# EAGLE design square (EAGLE 8.2.2)

## Sheet 1 of 4
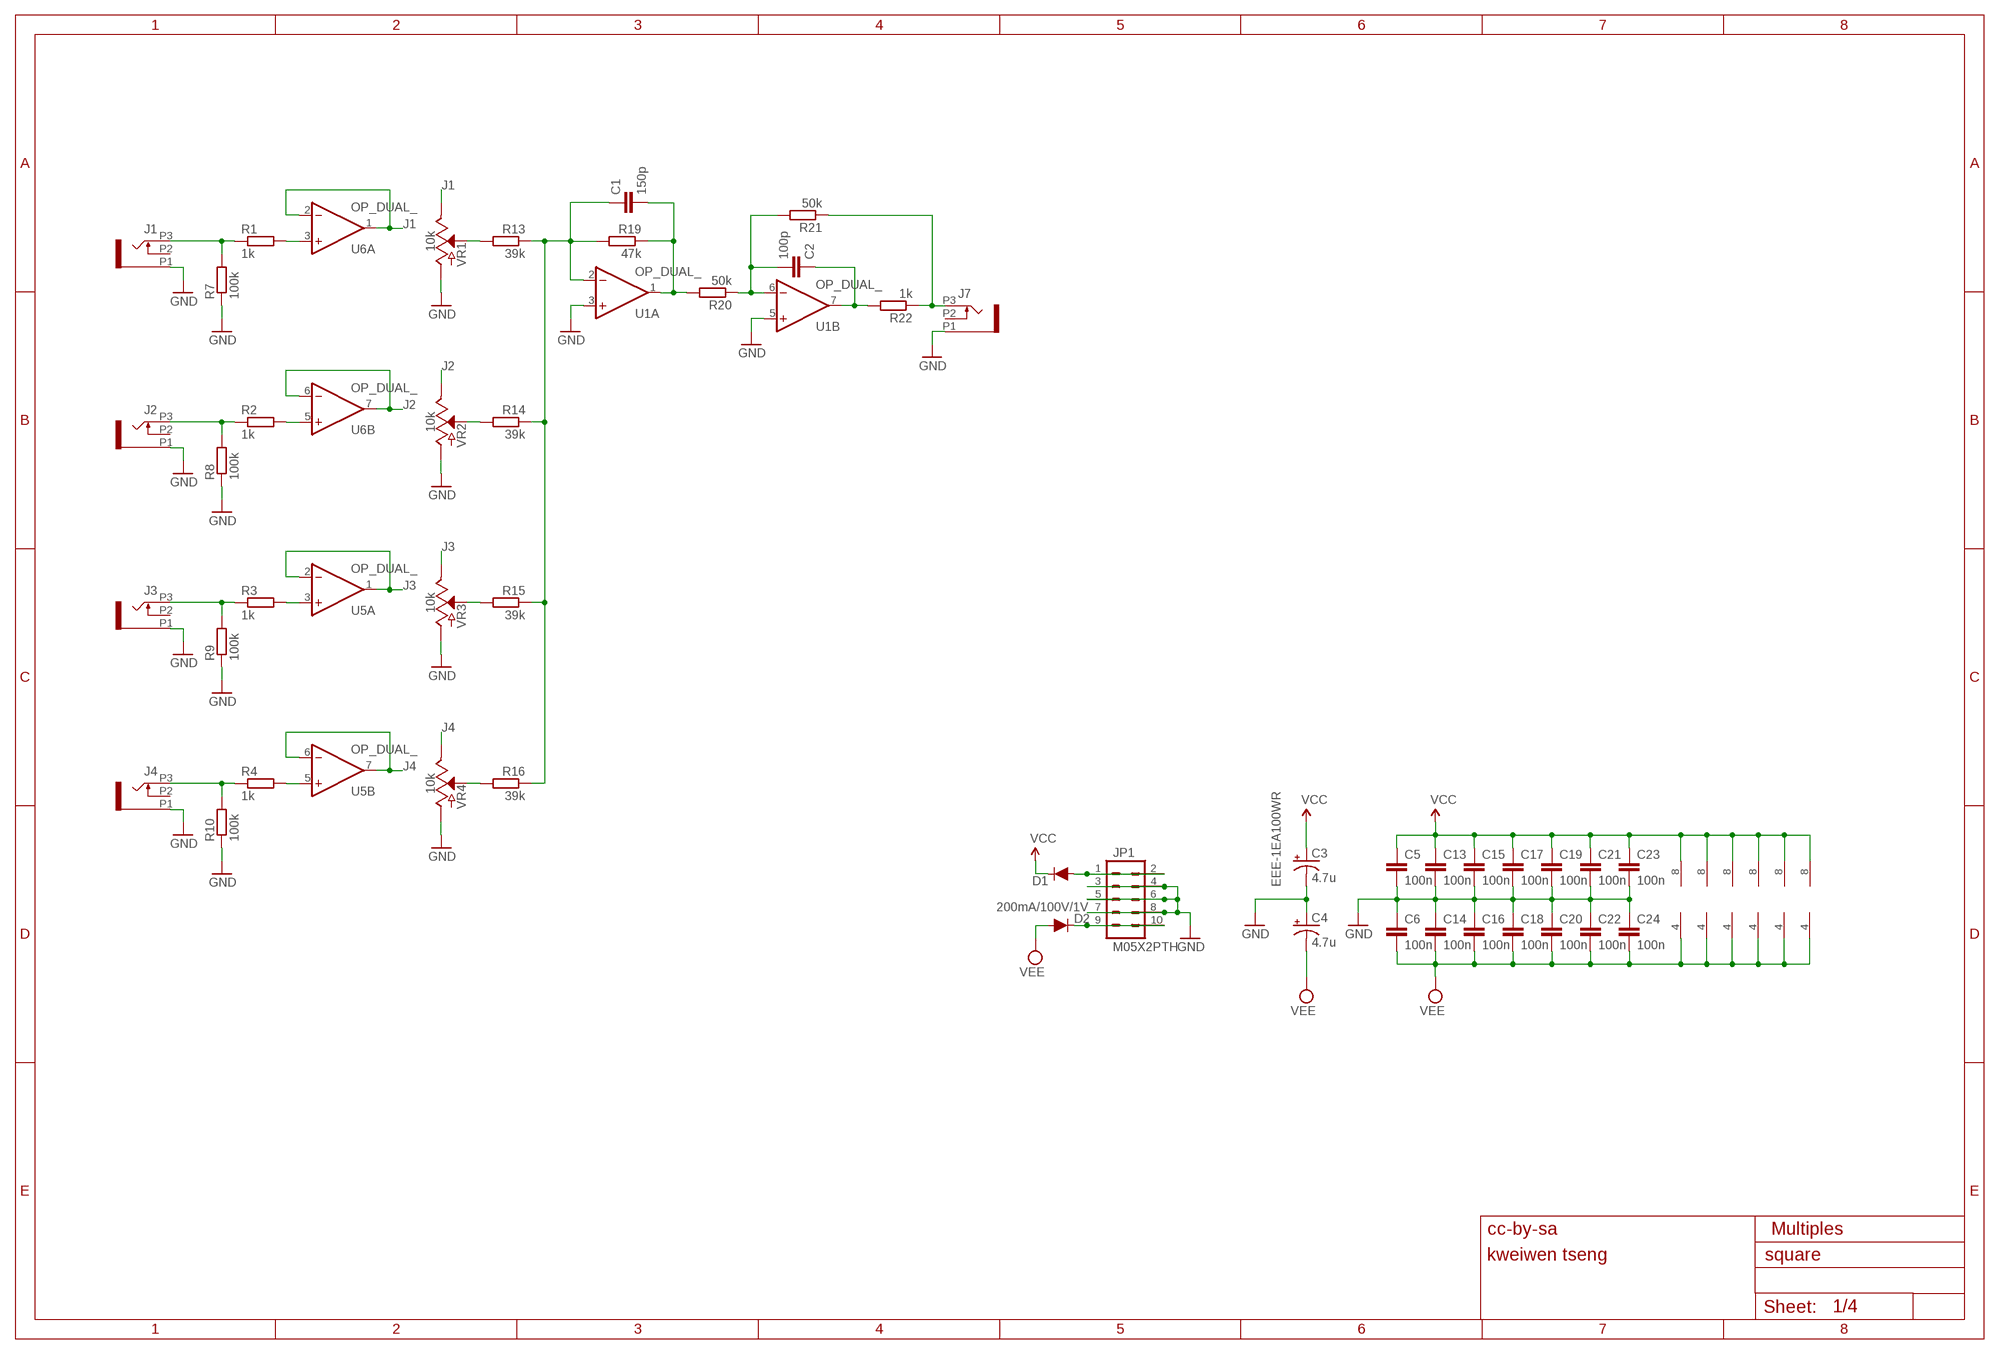
[diagram p0: schematic, sheet 1]

### Parts
C1  150p  C5/2.5  [C5B2.5]
C2  100p  C5/2.5  [C5B2.5]
C3  4.7u  CPOL-USE2.5-6  [E2,5-6]
C4  4.7u  CPOL-USE2.5-6  [E2,5-6]
C5  100n  C5/2.5  [C5B2.5]
C6  100n  C5/2.5  [C5B2.5]
C13  100n  C5/2.5  [C5B2.5]
C14  100n  C5/2.5  [C5B2.5]
C15  100n  C5/2.5  [C5B2.5]
C16  100n  C5/2.5  [C5B2.5]
C17  100n  C5/2.5  [C5B2.5]
C18  100n  C5/2.5  [C5B2.5]
C19  100n  C5/2.5  [C5B2.5]
C20  100n  C5/2.5  [C5B2.5]
C21  100n  C5/2.5  [C5B2.5]
C22  100n  C5/2.5  [C5B2.5]
C23  100n  C5/2.5  [C5B2.5]
C24  100n  C5/2.5  [C5B2.5]
D1  200mA/100V/1V  DIODE-1N4148  [DIODE-1N4148]
D2  200mA/100V/1V  DIODE-1N4148  [DIODE-1N4148]
J1  PJ301_THONKICONN6  [WQP_PJ_301M6]
J2  PJ301_THONKICONN6  [WQP_PJ_301M6]
J3  PJ301_THONKICONN6  [WQP_PJ_301M6]
J4  PJ301_THONKICONN6  [WQP_PJ_301M6]
J7  PJ301_THONKICONN6  [WQP_PJ_301M6]
JP1  M05X2PTH  [AVR_ICSP]
R1  1k  RESISTORVERTICAL  [VERTICAL_RESISTOR]
R2  1k  RESISTORVERTICAL  [VERTICAL_RESISTOR]
R3  1k  RESISTORVERTICAL  [VERTICAL_RESISTOR]
R4  1k  RESISTORVERTICAL  [VERTICAL_RESISTOR]
R7  100k  RESISTORVERTICAL  [VERTICAL_RESISTOR]
R8  100k  RESISTORVERTICAL  [VERTICAL_RESISTOR]
R9  100k  RESISTORVERTICAL  [VERTICAL_RESISTOR]
R10  100k  RESISTORVERTICAL  [VERTICAL_RESISTOR]
R13  39k  RESISTORVERTICAL  [VERTICAL_RESISTOR]
R14  39k  RESISTORVERTICAL  [VERTICAL_RESISTOR]
R15  39k  RESISTORVERTICAL  [VERTICAL_RESISTOR]
R16  39k  RESISTORVERTICAL  [VERTICAL_RESISTOR]
R19  47k  RESISTORVERTICAL  [VERTICAL_RESISTOR]
R20  50k  RESISTORVERTICAL  [VERTICAL_RESISTOR]
R21  50k  RESISTORVERTICAL  [VERTICAL_RESISTOR]
R22  1k  RESISTORVERTICAL  [VERTICAL_RESISTOR]
U1  OP_DUAL_  [DIL08]
U2  OP_DUAL_  [DIL08]
U3  OP_DUAL_  [DIL08]
U4  OP_DUAL_  [DIL08]
U5  OP_DUAL_  [DIL08]
U6  OP_DUAL_  [DIL08]
VR1  10k  POTENTIOMETER-PTH-9MM-1/20W-20%-KIT  [POT-PTH-ALPS-KIT]
VR2  10k  POTENTIOMETER-PTH-9MM-1/20W-20%-KIT  [POT-PTH-ALPS-KIT]
VR3  10k  POTENTIOMETER-PTH-9MM-1/20W-20%-KIT  [POT-PTH-ALPS-KIT]
VR4  10k  POTENTIOMETER-PTH-9MM-1/20W-20%-KIT  [POT-PTH-ALPS-KIT]

### Nets
GND: C3.- C4.+ C5.2 C6.1 J1.P1 J2.P1 J3.P1 J4.P1 J7.P1 JP1.3 JP1.4 JP1.5 JP1.6 JP1.7 JP1.8 R7.1 R8.1 R9.1 R10.1 U1.3(A:+IN) U1.5(B:+IN) VR1.P$1(A) VR2.P$1(A) VR3.P$1(A) VR4.P$1(A) ; also sheet 2,3,4
GND1: C13.2 C14.1
GND2: C15.2 C16.1
GND3: C17.2 C18.1
GND4: C19.2 C20.1
GND5: C21.2 C22.1
GND6: C23.2 C24.1
J1: U6.1(A:OUT) U6.2(A:-IN) VR1.P$3(E) ; also sheet 2,3,4
J2: U6.6(B:-IN) U6.7(B:OUT) VR2.P$3(E) ; also sheet 2,3,4
J3: U5.1(A:OUT) U5.2(A:-IN) VR3.P$3(E) ; also sheet 2,3,4
J4: U5.6(B:-IN) U5.7(B:OUT) VR4.P$3(E) ; also sheet 2,3,4
N$1: C1.1 R13.1 R14.1 R15.1 R16.1 R19.2 U1.2(A:-IN)
N$2: R13.2 VR1.P$2(S)
N$3: R16.2 VR4.P$2(S)
N$4: R1.2 U6.3(A:+IN)
N$5: R14.2 VR2.P$2(S)
N$6: D1.A JP1.1 JP1.2
N$7: R15.2 VR3.P$2(S)
N$9: C1.2 R19.1 R20.2 U1.1(A:OUT)
N$10: C2.2 R20.1 R21.2 U1.6(B:-IN)
N$11: C2.1 R22.2 U1.7(B:OUT)
N$12: J7.P3 R21.1 R22.1
N$15: R2.2 U6.5(B:+IN)
N$17: R3.2 U5.3(A:+IN)
N$20: D2.C JP1.9 JP1.10
N$21: J1.P3 R1.1 R7.2
N$31: J2.P3 R2.1 R8.2
N$33: J3.P3 R3.1 R9.2
N$34: J4.P3 R4.1 R10.2
N$40: R4.2 U5.5(B:+IN)
VCC: C3.+ C5.1 C13.1 C15.1 C17.1 C19.1 C21.1 C23.1 D1.C U1.8(P:V+) U2.8(P:V+) U3.8(P:V+) U4.8(P:V+) U5.8(P:V+) U6.8(P:V+)
VEE: C4.- C6.2 C14.2 C16.2 C18.2 C20.2 C22.2 C24.2 D2.A U1.4(P:V-) U2.4(P:V-) U3.4(P:V-) U4.4(P:V-) U5.4(P:V-) U6.4(P:V-)
Unconnected: J1.P2 J2.P2 J3.P2 J4.P2 J7.P2

### Notes on the sheet
- EEE-1EA100WR
- cc-by-sa | Multiples
- kweiwen tseng

## Sheet 2 of 4
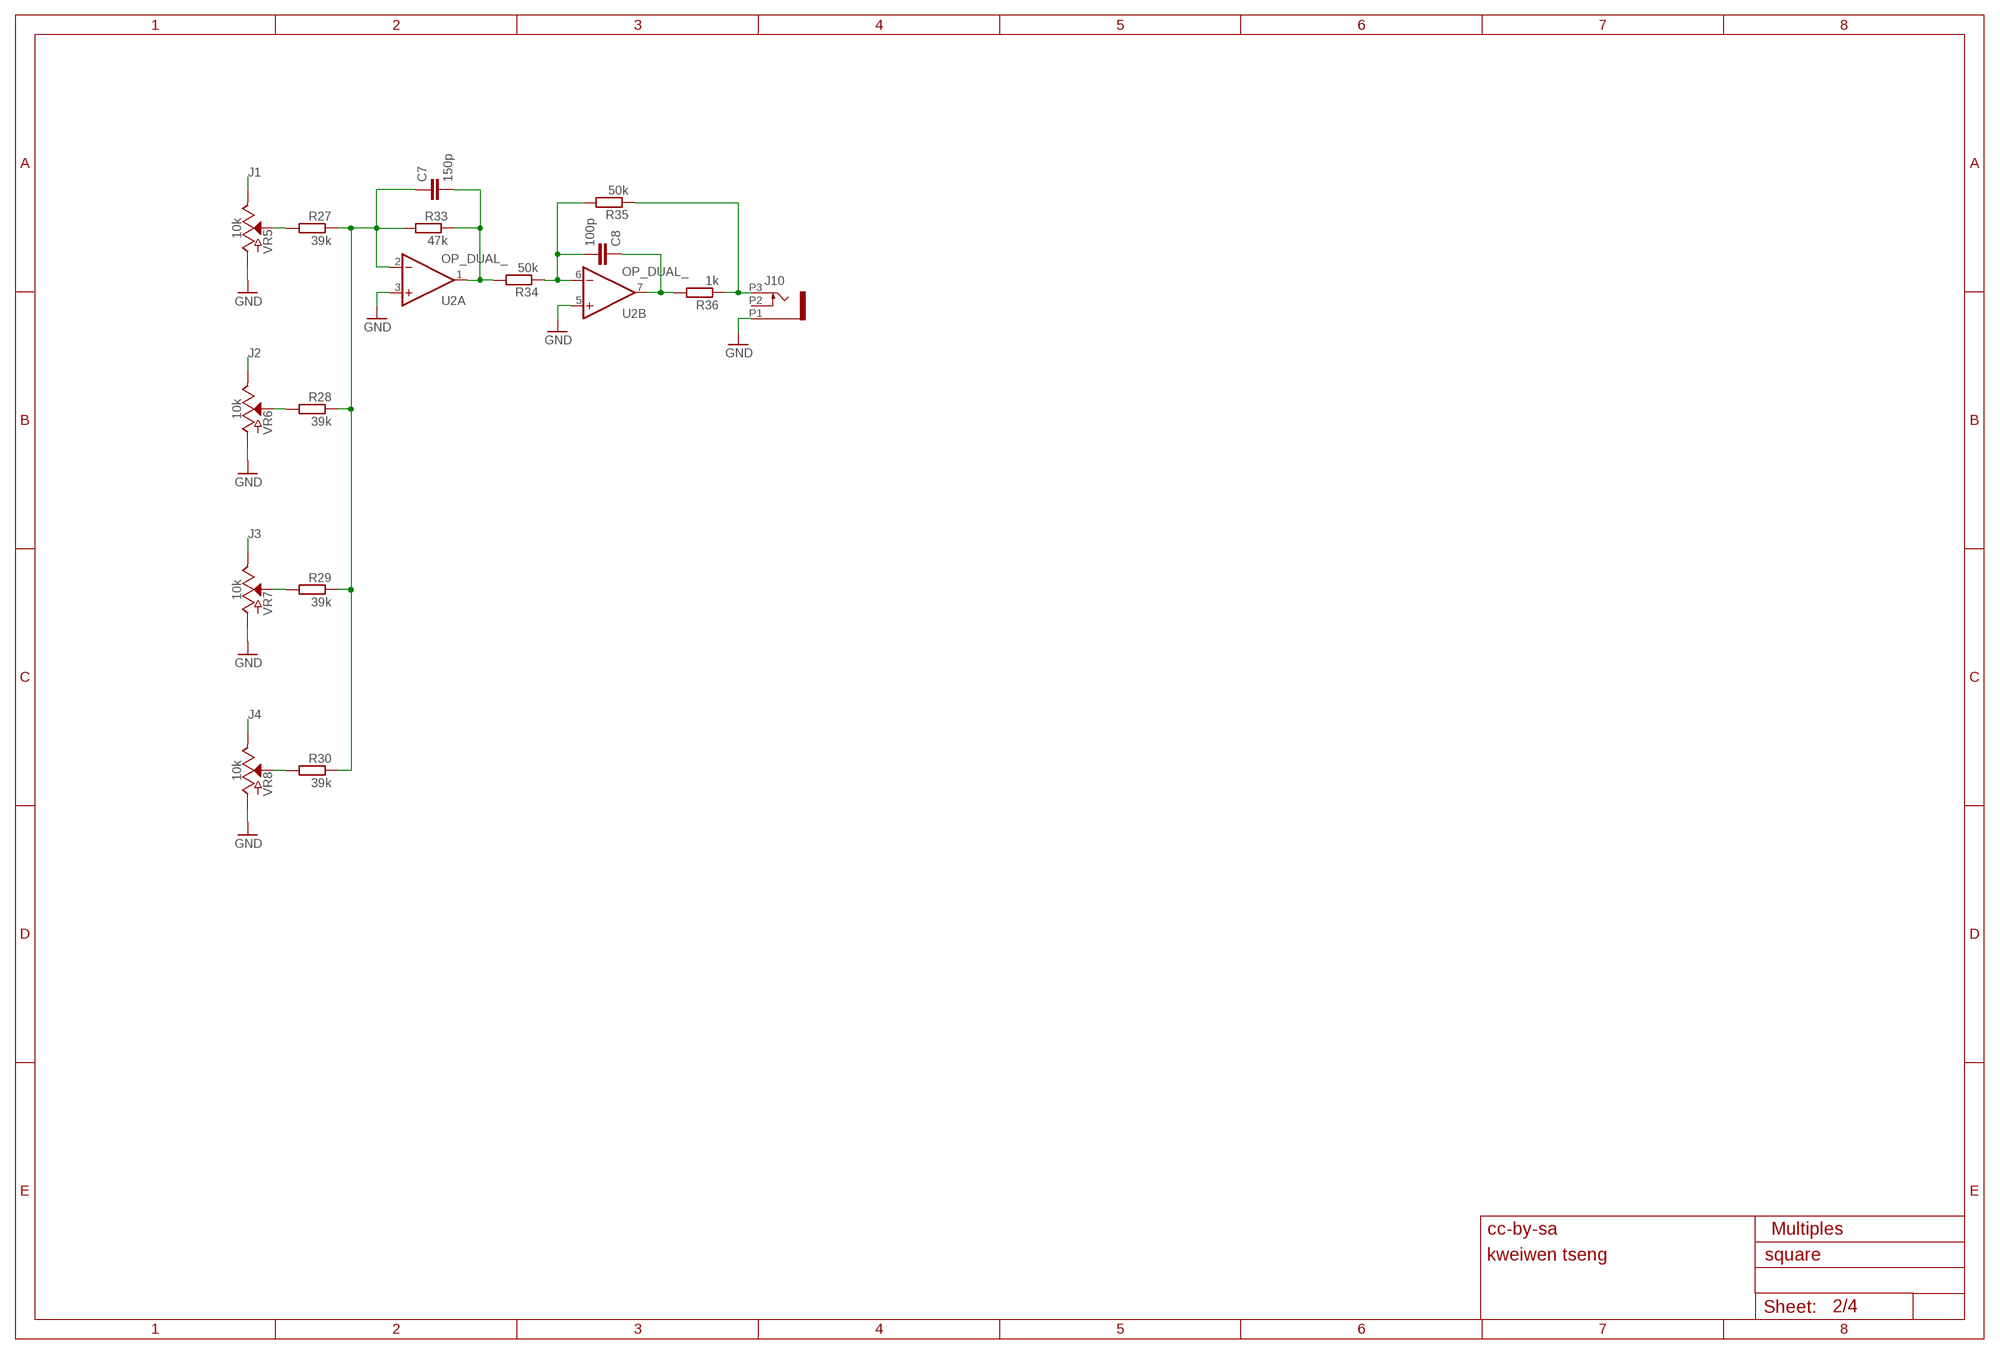
[diagram p1: schematic, sheet 2]

### Parts
C7  150p  C5/2.5  [C5B2.5]
C8  100p  C5/2.5  [C5B2.5]
J10  PJ301_THONKICONN6  [WQP_PJ_301M6]
R27  39k  RESISTORVERTICAL  [VERTICAL_RESISTOR]
R28  39k  RESISTORVERTICAL  [VERTICAL_RESISTOR]
R29  39k  RESISTORVERTICAL  [VERTICAL_RESISTOR]
R30  39k  RESISTORVERTICAL  [VERTICAL_RESISTOR]
R33  47k  RESISTORVERTICAL  [VERTICAL_RESISTOR]
R34  50k  RESISTORVERTICAL  [VERTICAL_RESISTOR]
R35  50k  RESISTORVERTICAL  [VERTICAL_RESISTOR]
R36  1k  RESISTORVERTICAL  [VERTICAL_RESISTOR]
VR5  10k  POTENTIOMETER-PTH-9MM-1/20W-20%-KIT  [POT-PTH-ALPS-KIT]
VR6  10k  POTENTIOMETER-PTH-9MM-1/20W-20%-KIT  [POT-PTH-ALPS-KIT]
VR7  10k  POTENTIOMETER-PTH-9MM-1/20W-20%-KIT  [POT-PTH-ALPS-KIT]
VR8  10k  POTENTIOMETER-PTH-9MM-1/20W-20%-KIT  [POT-PTH-ALPS-KIT]

### Nets
GND: J10.P1 U2.3(A:+IN) U2.5(B:+IN) VR5.P$1(A) VR6.P$1(A) VR7.P$1(A) VR8.P$1(A) ; also sheet 1,3,4
J1: VR5.P$3(E) ; also sheet 1,3,4
J2: VR6.P$3(E) ; also sheet 1,3,4
J3: VR7.P$3(E) ; also sheet 1,3,4
J4: VR8.P$3(E) ; also sheet 1,3,4
N$23: R30.2 VR8.P$2(S)
N$24: C7.1 R27.1 R28.1 R29.1 R30.1 R33.2 U2.2(A:-IN)
N$25: C7.2 R33.1 R34.2 U2.1(A:OUT)
N$26: C8.2 R34.1 R35.2 U2.6(B:-IN)
N$27: J10.P3 R35.1 R36.1
N$29: C8.1 R36.2 U2.7(B:OUT)
N$36: R27.2 VR5.P$2(S)
N$37: R28.2 VR6.P$2(S)
N$38: R29.2 VR7.P$2(S)
Unconnected: J10.P2

### Notes on the sheet
- cc-by-sa | Multiples
- kweiwen tseng

## Sheet 3 of 4
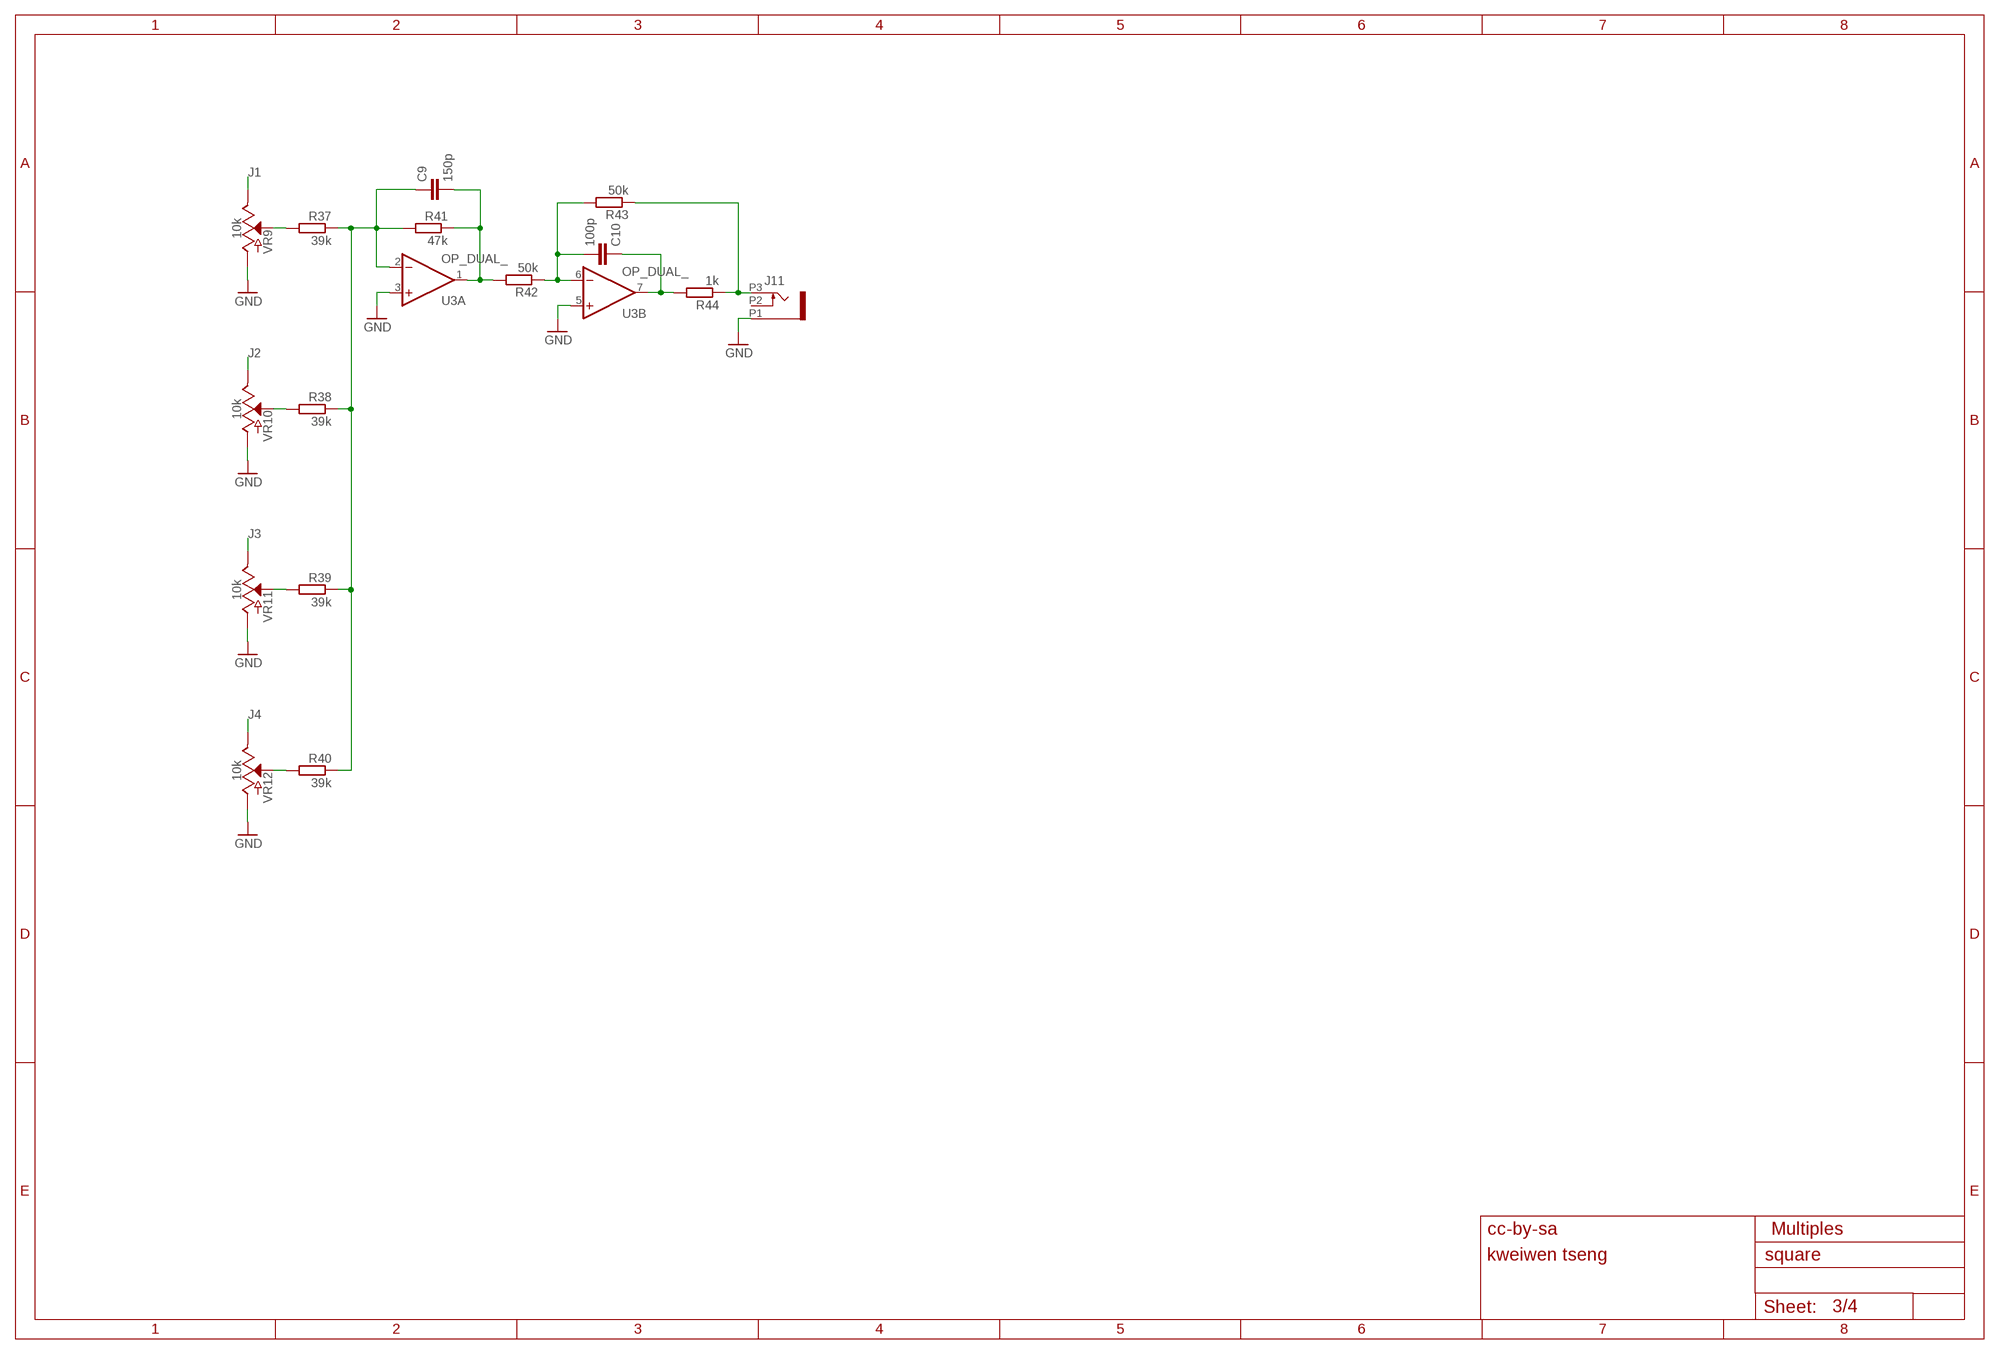
[diagram p2: schematic, sheet 3]

### Parts
C9  150p  C5/2.5  [C5B2.5]
C10  100p  C5/2.5  [C5B2.5]
J11  PJ301_THONKICONN6  [WQP_PJ_301M6]
R37  39k  RESISTORVERTICAL  [VERTICAL_RESISTOR]
R38  39k  RESISTORVERTICAL  [VERTICAL_RESISTOR]
R39  39k  RESISTORVERTICAL  [VERTICAL_RESISTOR]
R40  39k  RESISTORVERTICAL  [VERTICAL_RESISTOR]
R41  47k  RESISTORVERTICAL  [VERTICAL_RESISTOR]
R42  50k  RESISTORVERTICAL  [VERTICAL_RESISTOR]
R43  50k  RESISTORVERTICAL  [VERTICAL_RESISTOR]
R44  1k  RESISTORVERTICAL  [VERTICAL_RESISTOR]
VR9  10k  POTENTIOMETER-PTH-9MM-1/20W-20%-KIT  [POT-PTH-ALPS-KIT]
VR10  10k  POTENTIOMETER-PTH-9MM-1/20W-20%-KIT  [POT-PTH-ALPS-KIT]
VR11  10k  POTENTIOMETER-PTH-9MM-1/20W-20%-KIT  [POT-PTH-ALPS-KIT]
VR12  10k  POTENTIOMETER-PTH-9MM-1/20W-20%-KIT  [POT-PTH-ALPS-KIT]

### Nets
GND: J11.P1 U3.3(A:+IN) U3.5(B:+IN) VR9.P$1(A) VR10.P$1(A) VR11.P$1(A) VR12.P$1(A) ; also sheet 1,2,4
J1: VR9.P$3(E) ; also sheet 1,2,4
J2: VR10.P$3(E) ; also sheet 1,2,4
J3: VR11.P$3(E) ; also sheet 1,2,4
J4: VR12.P$3(E) ; also sheet 1,2,4
N$53: R40.2 VR12.P$2(S)
N$54: C9.1 R37.1 R38.1 R39.1 R40.1 R41.2 U3.2(A:-IN)
N$55: C9.2 R41.1 R42.2 U3.1(A:OUT)
N$56: C10.2 R42.1 R43.2 U3.6(B:-IN)
N$57: J11.P3 R43.1 R44.1
N$58: C10.1 R44.2 U3.7(B:OUT)
N$62: R37.2 VR9.P$2(S)
N$63: R38.2 VR10.P$2(S)
N$64: R39.2 VR11.P$2(S)
Unconnected: J11.P2

### Notes on the sheet
- cc-by-sa | Multiples
- kweiwen tseng

## Sheet 4 of 4
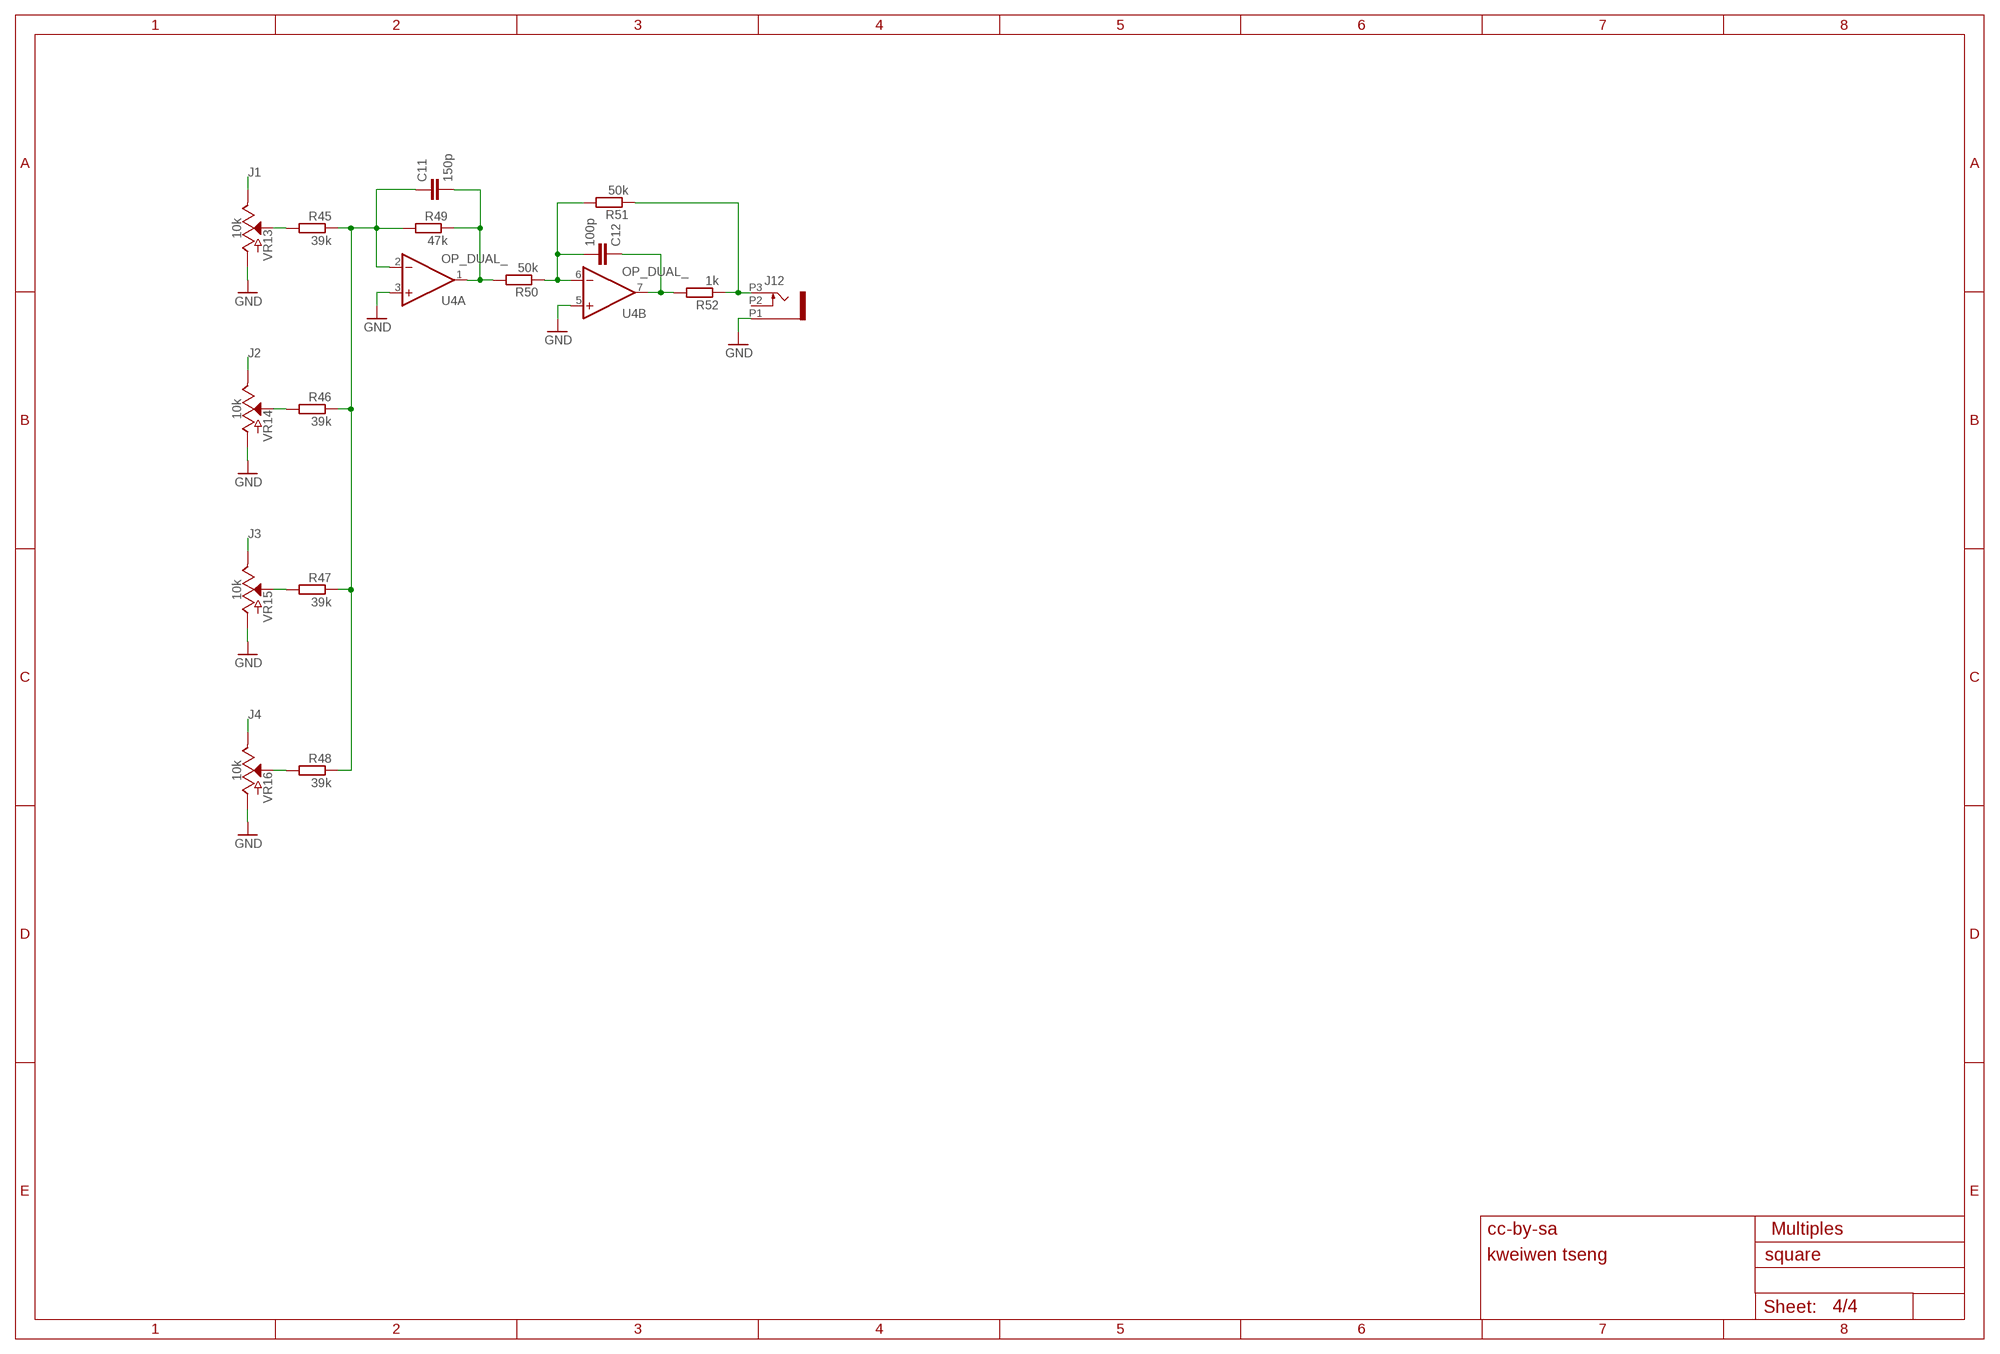
[diagram p3: schematic, sheet 4]

### Parts
C11  150p  C5/2.5  [C5B2.5]
C12  100p  C5/2.5  [C5B2.5]
J12  PJ301_THONKICONN6  [WQP_PJ_301M6]
R45  39k  RESISTORVERTICAL  [VERTICAL_RESISTOR]
R46  39k  RESISTORVERTICAL  [VERTICAL_RESISTOR]
R47  39k  RESISTORVERTICAL  [VERTICAL_RESISTOR]
R48  39k  RESISTORVERTICAL  [VERTICAL_RESISTOR]
R49  47k  RESISTORVERTICAL  [VERTICAL_RESISTOR]
R50  50k  RESISTORVERTICAL  [VERTICAL_RESISTOR]
R51  50k  RESISTORVERTICAL  [VERTICAL_RESISTOR]
R52  1k  RESISTORVERTICAL  [VERTICAL_RESISTOR]
VR13  10k  POTENTIOMETER-PTH-9MM-1/20W-20%-KIT  [POT-PTH-ALPS-KIT]
VR14  10k  POTENTIOMETER-PTH-9MM-1/20W-20%-KIT  [POT-PTH-ALPS-KIT]
VR15  10k  POTENTIOMETER-PTH-9MM-1/20W-20%-KIT  [POT-PTH-ALPS-KIT]
VR16  10k  POTENTIOMETER-PTH-9MM-1/20W-20%-KIT  [POT-PTH-ALPS-KIT]

### Nets
GND: J12.P1 U4.3(A:+IN) U4.5(B:+IN) VR13.P$1(A) VR14.P$1(A) VR15.P$1(A) VR16.P$1(A) ; also sheet 1,2,3
J1: VR13.P$3(E) ; also sheet 1,2,3
J2: VR14.P$3(E) ; also sheet 1,2,3
J3: VR15.P$3(E) ; also sheet 1,2,3
J4: VR16.P$3(E) ; also sheet 1,2,3
N$109: R48.2 VR16.P$2(S)
N$110: C11.1 R45.1 R46.1 R47.1 R48.1 R49.2 U4.2(A:-IN)
N$111: C11.2 R49.1 R50.2 U4.1(A:OUT)
N$112: C12.2 R50.1 R51.2 U4.6(B:-IN)
N$113: J12.P3 R51.1 R52.1
N$114: C12.1 R52.2 U4.7(B:OUT)
N$118: R45.2 VR13.P$2(S)
N$119: R46.2 VR14.P$2(S)
N$120: R47.2 VR15.P$2(S)
Unconnected: J12.P2

### Notes on the sheet
- cc-by-sa | Multiples
- kweiwen tseng

## Library data of the parts
C1 C2 C5-C24 = capacitor-wima:C: CAPACITOR naming: grid - package width
C3 C4 = resistor:CPOL-US: POLARIZED CAPACITOR, American symbol
D1 D2 = SparkFun-DiscreteSemi:DIODE: Diode These are standard reverse protection diodes and small signal diodes. SparkFun Products: SparkFun SparkPunk Sound Kit <https://www.sparkfun.com/products/11177> SparkFun ESP8266 Thing <https://www.sparkfun.com/products/13231>; PROD_ID: DIO-08378
J1-J4 J7 J10-J12 = og-pj301:PJ301_THONKICONN
JP1 = og-header:M05X2: Header 5x2 Standard 10-pin dual row 0.1" header. Commonly used with AVR-ISP. Use with Spark Fun Electronics SKU: PRT-00778
R1-R4 R7-R10 R13-R16 R19-R22 R27-R30 R33-R52 = kweiwen:*RESISTOR*: Standard resistor, various versions
U1-U6 = kweiwen:OP_DUAL: Generic Dual Op Amp
VR1-VR16 = kweiwen:POTENTIOMETER: Potentiometer (Pot) Three-terminal potentiometers, with an adjustable wiper and two adjustable resistors. A pot can be used to create a configurable voltage divider, or as a variable resistor. Variants ALPS_POT and ALPS_POT_KIT - PTH, breadboard compatible, 9mm square pots Rotary Potentiometer - Linear (10k ohm) <https://www.sparkfun.com/products/9288> (COM-09288) The KIT variant exposes copper on only one side of the PTH pad, so the part can only be assembled on one side of the PCB. Useful for beginner soldering kits.; PROD_ID: RES-09177; SF_SKU: COM-09288

## Net classes
0 default: width 0.305 mm

## Board
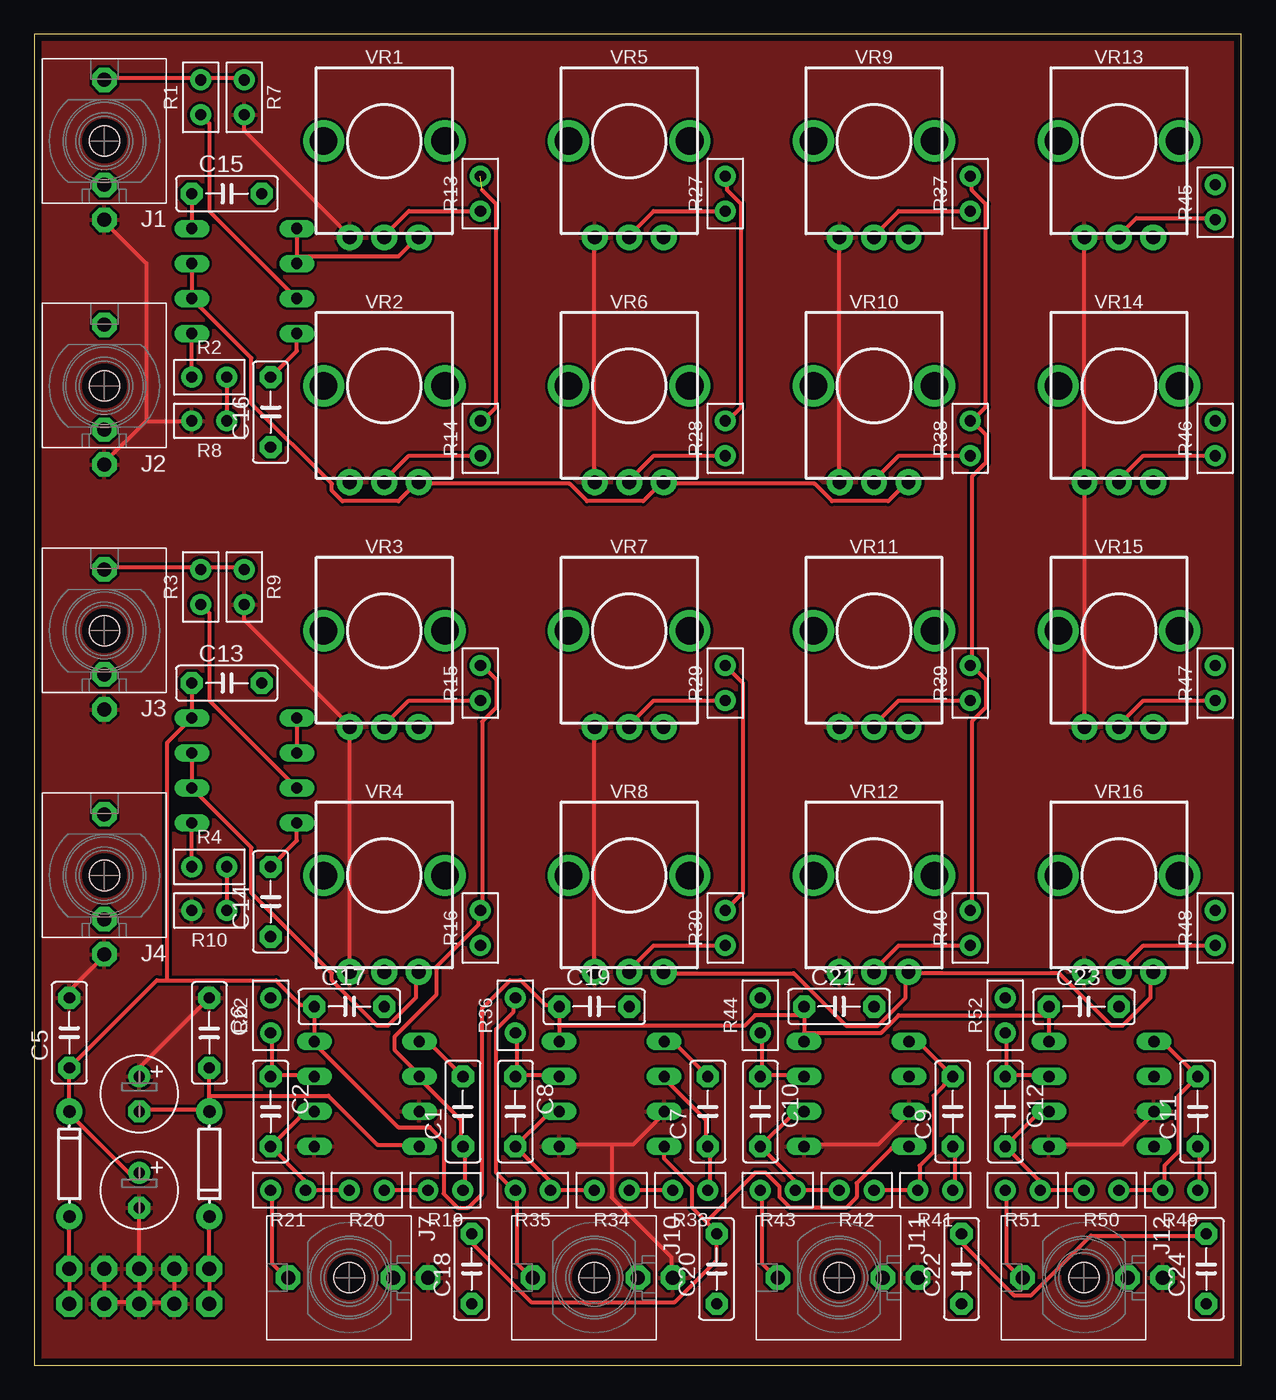
[diagram p4: board, top side]
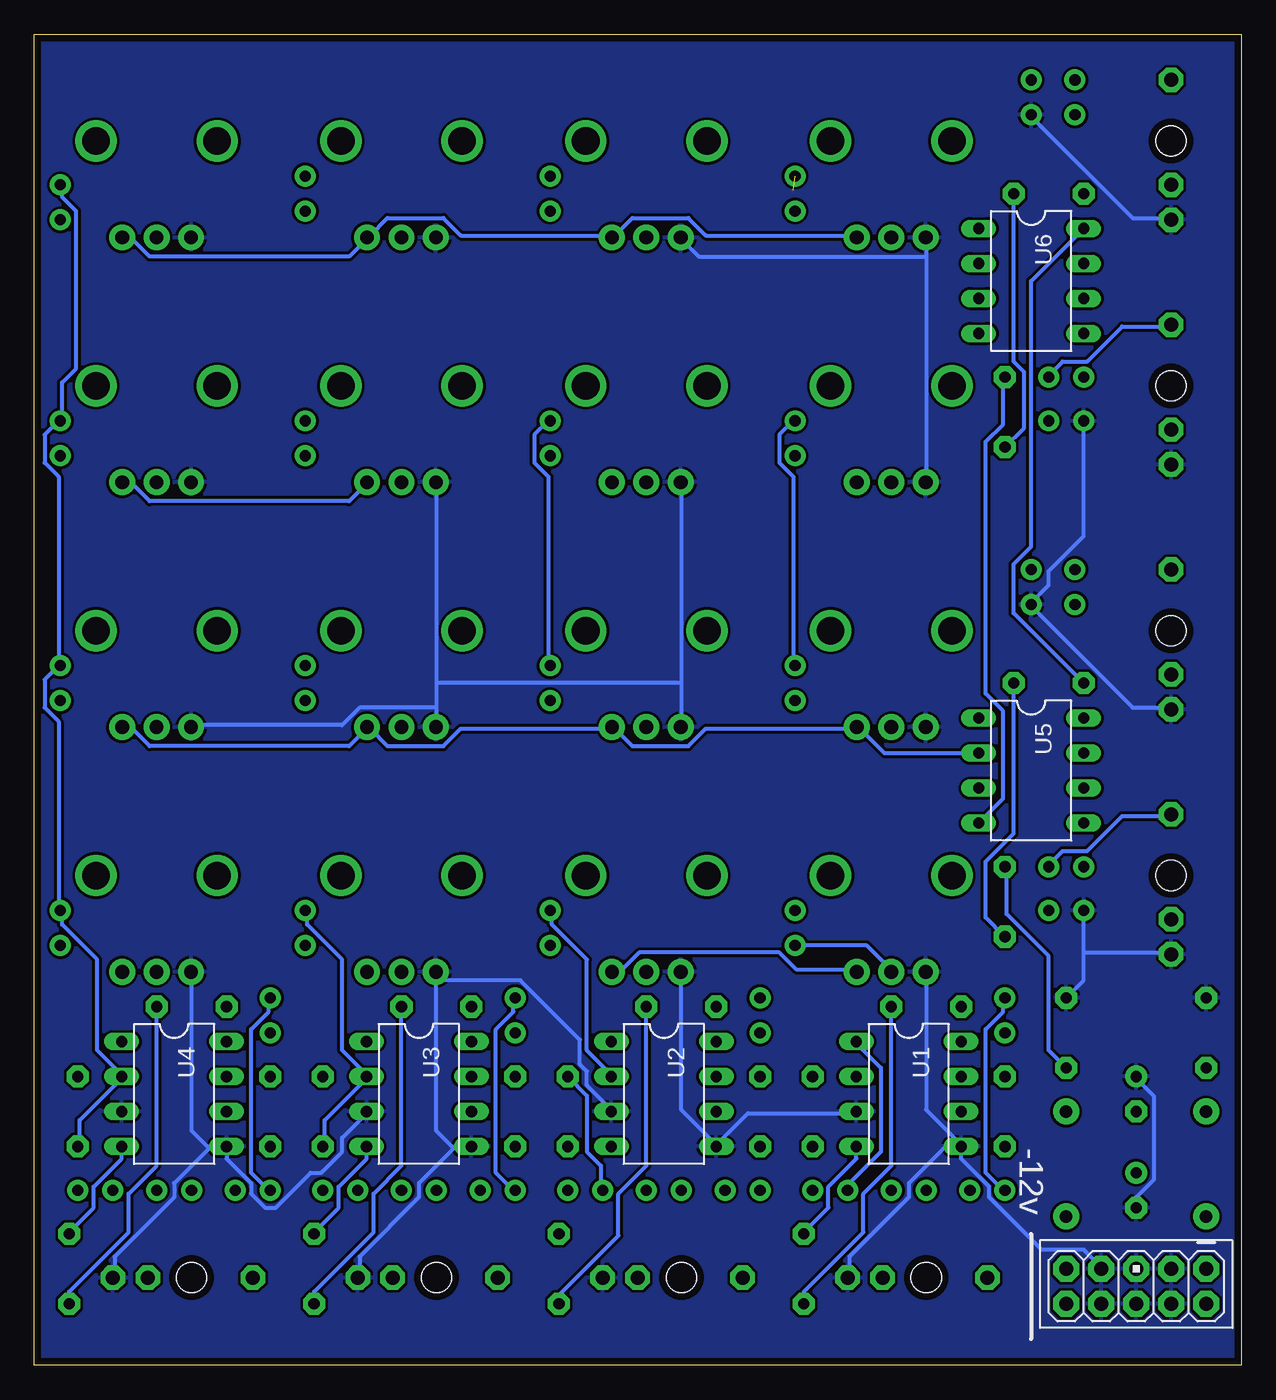
[diagram p5: board, bottom side, seen from below]

Size 87.61 x 96.65 mm. Coordinates in mm from the lower left corner, seen from the top.
Outline: 87.61,96.65 0,96.65 0,0 87.61,0 87.61,96.65
Copper layers (1*16): Top 0.035mm / dielectric 1.5mm / Bottom 0.035mm
Design rules "PCBCart-Standard *": minimum track width 8mil, minimum drill 0.4mm, track to track 8mil, track to pad 8mil, pad to pad 8mil, via to via 8mil, smd to smd 8mil, copper to edge 20mil, drill to drill 8mil, minimum pad ring 8mil, minimum via ring 10mil, stop-mask expansion 3mil, vias tented up to drill 25mil, thermal gap 8mil

### Footprints (pad centres in the part's own frame; a part is rotated, then mirrored left to right if it is on the bottom)
C5B2.5 = drill 0.813 pad 1.6 octagon: 1 -2.54,0; 2 2.54,0
E2,5-6 = drill 0.813 pad 1.6: + -1.27,0 | drill 0.813 pad 1.6 octagon: - 1.27,0
DIODE-1N4148 = drill 0.9 pad 1.88: A -3.81,0; C 3.81,0
WQP_PJ_301M6 = drill 1.016 pad 1.778 octagon: P1 0,-5.715; P2 0,-3.175; P3 0,4.445 | hole 2.2: 0,0
AVR_ICSP = drill 1.016 pad 1.88 octagon: 1 -1.27,5.08; 2 1.27,5.08; 3 -1.27,2.54; 4 1.27,2.54; 5 -1.27,0; 6 1.27,0; 7 -1.27,-2.54; 8 1.27,-2.54; 9 -1.27,-5.08; 10 1.27,-5.08
VERTICAL_RESISTOR = drill 0.813 pad 1.524: 1 -1.27,0; 2 1.27,0
DIL08 = drill 0.813 pad 1.27 long: 1 -3.81,-3.81; 2 -1.27,-3.81; 3 1.27,-3.81; 4 3.81,-3.81; 5 3.81,3.81; 6 1.27,3.81; 7 -1.27,3.81; 8 -3.81,3.81
POT-PTH-ALPS-KIT = drill 1 pad 1.88: P$1 7,-2.5; P$2 7,0; P$3 7,2.5 | drill 2: P$4 0,-4.4; P$5 0,4.4

### Placement (x,y rotation side)
C1  31.11,18.41 90 top
C2  17.14,18.41 270 top
C3  7.62,12.7 270 top
C4  7.62,19.68 270 top
C5  2.54,24.13 90 top
C6  12.7,24.13 270 top
C7  48.9,18.41 90 top
C8  34.92,18.41 270 top
C9  66.67,18.41 90 top
C10  52.7,18.41 270 top
C11  84.45,18.41 90 top
C12  70.48,18.41 270 top
C13  13.97,49.53 0 top
C14  17.14,33.66 90 top
C15  13.97,85.09 0 top
C16  17.14,69.22 90 top
C17  22.86,26.04 0 top
C18  31.75,6.99 90 top
C19  40.64,26.04 0 top
C20  49.53,6.99 90 top
C21  58.42,26.04 0 top
C22  67.31,6.99 90 top
C23  76.2,26.04 0 top
C24  85.09,6.99 90 top
D1  2.54,14.61 90 top
D2  12.7,14.61 270 top
J1  5.08,88.9 0 top
J2  5.08,71.12 0 top
J3  5.08,53.34 0 top
J4  5.08,35.56 0 top
J7  22.86,6.35 90 top
J10  40.64,6.35 90 top
J11  58.42,6.35 90 top
J12  76.2,6.35 90 top
JP1  7.62,5.71 270 bottom
R1  12.06,92.08 270 top
R2  12.7,71.75 180 top
R3  12.06,56.52 270 top
R4  12.7,36.2 180 top
R7  15.24,92.08 90 top
R8  12.7,68.58 0 top
R9  15.24,56.52 90 top
R10  12.7,33.02 0 top
R13  32.38,85.09 270 top
R14  32.38,67.31 270 top
R15  32.38,49.53 270 top
R16  32.38,31.75 270 top
R19  29.84,12.7 0 top
R20  24.13,12.7 0 top
R21  18.41,12.7 0 top
R22  17.14,25.4 270 top
R27  50.16,85.09 270 top
R28  50.16,67.31 270 top
R29  50.16,49.53 270 top
R30  50.16,31.75 270 top
R33  47.62,12.7 0 top
R34  41.91,12.7 0 top
R35  36.2,12.7 0 top
R36  34.92,25.4 270 top
R37  67.94,85.09 270 top
R38  67.94,67.31 270 top
R39  67.94,49.53 270 top
R40  67.94,31.75 270 top
R41  65.41,12.7 0 top
R42  59.69,12.7 0 top
R43  53.98,12.7 0 top
R44  52.7,25.4 270 top
R45  85.72,84.45 270 top
R46  85.72,67.31 270 top
R47  85.72,49.53 270 top
R48  85.72,31.75 270 top
R49  83.19,12.7 0 top
R50  77.47,12.7 0 top
R51  71.75,12.7 0 top
R52  70.48,25.4 270 top
U1  24.13,19.68 270 bottom
U2  41.91,19.68 270 bottom
U3  59.69,19.68 270 bottom
U4  77.47,19.68 270 bottom
U5  15.24,43.18 270 bottom
U6  15.24,78.74 270 bottom
VR1  25.4,88.9 270 top
VR2  25.4,71.12 270 top
VR3  25.4,53.34 270 top
VR4  25.4,35.56 270 top
VR5  43.18,88.9 270 top
VR6  43.18,71.12 270 top
VR7  43.18,53.34 270 top
VR8  43.18,35.56 270 top
VR9  60.96,88.9 270 top
VR10  60.96,71.12 270 top
VR11  60.96,53.34 270 top
VR12  60.96,35.56 270 top
VR13  78.74,88.9 270 top
VR14  78.74,71.12 270 top
VR15  78.74,53.34 270 top
VR16  78.74,35.56 270 top

### Tracks (layer width: path | path; a pad name or v marks a point on that pad's centre or on a via)
GND
  Top 0.305: JP1.7 10.16,4.57 | JP1.3 5.08,4.57 | C3.- JP1.5 7.62,4.57 | 7.62,4.57 5.08,4.57 | 5.08,4.57 JP1.4 | 7.62,4.57 10.16,4.57 | 10.16,4.57 JP1.8 | 7.62,4.57 JP1.6 | C5.2 2.54,27.18 5.08,29.72 J4.P1 | C4.+ 7.62,21.59 C6.1 | 8.13,68.58 R8.1 | 8.13,68.58 5.08,65.53 J2.P1 | R9.1 15.24,54.1 22.86,46.48 VR3.P$1 22.86,46.23 22.86,28.7 VR4.P$1 | R7.1 15.24,89.66 22.86,82.04 VR1.P$1 | 8.13,68.58 8.13,80.01 5.08,83.06 J1.P1 | VR13.P$1 76.2,81.79 76.2,64.26 VR14.P$1 VR15.P$1 | U3.5 55.88,16 61.21,16 63.5,18.29 U3.3 | U4.5 73.66,16 78.99,16 81.28,18.29 U4.3 | VR9.P$1 58.42,81.79 58.42,64.26 VR10.P$1 | VR5.P$1 40.64,81.79 40.64,64.26 VR6.P$1 | 41.91,16 43.43,16 45.72,18.29 U2.3 | 41.91,16 38.1,16 U2.5 | 41.91,16 41.91,12.19 46.23,7.87 46.23,6.35 J10.P1 | VR7.P$1 40.64,46.23 40.64,28.7 VR8.P$1
  Bottom 0.305: 20.83,16.51 22.86,18.54 22.86,28.45 VR4.P$1 | 20.83,16.51 20.32,16 U1.5 20.32,14.99 18.29,12.95 18.29,12.19 14.48,8.38 11.43,8.38 10.16,7.11 JP1.7 | 20.83,16.51 24.13,13.21 24.13,12.19 28.45,7.87 28.45,6.35 J7.P1 | 11.43,29.97 11.43,27.94 C6.1 | 11.43,29.97 R10.1 | 11.43,29.97 5.08,29.97 J4.P1 | C3.- 7.62,12.19 6.35,13.46 6.35,19.56 7.62,20.83 C4.+ | J3.P1 5.08,47.75 7.87,47.75 15.24,55.12 R9.1 15.24,55.37 13.97,56.64 13.97,57.66 11.43,60.2 R8.1 | J1.P1 5.08,83.31 7.87,83.31 15.24,90.68 R7.1 | 22.86,80.52 22.86,81.79 VR1.P$1 | 22.86,80.52 22.86,64.26 VR2.P$1 | 57.15,15.75 59.69,13.21 59.69,12.19 64.01,7.87 64.01,6.35 J11.P1 | 57.15,15.75 55.88,15.75 U3.5 | 58.42,27.94 58.42,17.02 57.15,15.75 | 58.42,27.94 58.42,28.45 VR12.P$1 58.42,27.94 | 74.93,15.75 77.47,13.21 77.47,12.19 81.79,7.87 81.79,6.35 J12.P1 | 73.66,15.75 74.93,15.75 | 74.93,15.75 76.2,17.02 76.2,28.45 VR16.P$1 | 73.66,15.75 73.66,14.99 71.88,13.21 71.88,12.45 70.87,11.43 70.1,11.43 67.56,13.97 66.8,13.97 65.28,15.49 65.28,16.51 63.5,18.29 U3.3 | 73.66,15.75 U4.5 | 58.42,49.53 58.42,64.01 VR10.P$1 | 58.42,49.53 58.42,47.75 | 58.42,47.75 58.42,46.48 VR11.P$1 | 40.64,49.53 40.64,64.01 VR6.P$1 | 40.64,49.53 40.64,46.48 VR7.P$1 | 38.1,16 35.81,18.29 27.94,18.29 U1.3 | 38.1,16 40.64,18.54 40.64,28.45 VR8.P$1 | 38.1,16 U2.5 | 40.64,49.53 58.42,49.53 | 58.42,27.94 52.32,27.94 48.01,23.62 48.01,21.84 47.5,21.34 47.5,20.32 45.72,18.54 U2.3 | 58.42,47.75 64.01,47.75 65.28,46.48 76.2,46.48 VR15.P$1 | 22.86,80.52 39.37,80.52 40.64,81.79 VR5.P$1
  pour Bottom: 0,0 87.63,0 87.63,96.52 0,96.52
  pour Top: 0,0 87.63,0 87.63,96.52 0,96.52
GND1
  Bottom 0.305: C13.2 16.51,38.61 18.54,36.58 18.54,32.51 C14.1
GND2
  Bottom 0.305: C15.2 16.51,72.9 15.75,72.14 15.75,68.07 C16.1
GND3
  Bottom 0.305: C17.2 25.4,14.48 27.43,12.45 27.43,9.65 31.75,5.33 C18.1
GND4
  Bottom 0.305: C19.2 43.18,14.48 45.21,12.45 45.21,9.4 49.53,5.08 C20.1
GND5
  Bottom 0.305: C21.2 60.96,14.48 62.99,12.45 62.99,9.65 67.31,5.33 C22.1
GND6
  Bottom 0.305: C23.2 78.74,14.48 80.77,12.45 80.77,9.65 85.09,5.33 C24.1
J1
  Top 0.305: U6.1 19.05,80.52 | 19.05,80.52 26.42,80.52 27.69,81.79 VR1.P$3 | 19.05,80.52 U6.2
  Bottom 0.305: VR13.P$3 81.03,81.79 80.52,81.79 79.25,80.52 64.77,80.52 63.5,81.79 VR9.P$3 63.25,82.04 61.98,83.31 57.91,83.31 56.64,82.04 45.72,82.04 VR5.P$3 45.47,82.04 44.2,83.31 40.13,83.31 38.86,82.04 27.94,82.04 VR1.P$3
J2
  Top 0.305: U6.7 U6.6 15.75,73.15 15.75,69.85 21.59,64.01 21.59,63.5 22.35,62.74 26.42,62.74 27.69,64.01 VR2.P$3 27.94,64.01 38.86,64.01 40.13,62.74 44.2,62.74 45.47,64.01 VR6.P$3 45.72,64.01 56.64,64.01 57.91,62.74 61.98,62.74 63.25,64.01 VR10.P$3
  Bottom 0.305: VR14.P$3 81.03,64.01 80.52,64.01 79.25,62.74 64.77,62.74 63.5,64.01 VR10.P$3
J3
  Top 0.305: U5.1 U5.2
  Bottom 0.305: U5.2 25.91,44.45 27.69,46.23 VR3.P$3 27.94,46.23 38.86,46.23 40.13,44.96 44.2,44.96 45.47,46.23 VR7.P$3 45.72,46.23 56.64,46.23 57.91,44.96 61.98,44.96 63.25,46.23 VR11.P$3 63.5,46.23 64.77,44.96 79.25,44.96 80.52,46.23 81.03,46.23 VR15.P$3
J4
  Top 0.305: VR16.P$3 81.03,28.45 81.03,26.67 78.99,24.64 78.23,24.64 74.42,28.45 63.5,28.45 VR12.P$3 63.25,28.45 63.25,26.67 61.21,24.64 58.93,24.64 55.12,28.45 45.72,28.45 VR8.P$3 | U5.7 U5.6 15.75,37.59 15.75,34.29 21.59,28.45 21.59,27.94 24.89,24.64 25.65,24.64 27.69,26.67 27.69,28.45 VR4.P$3
  Bottom 0.305: VR8.P$3 45.47,28.7 44.96,28.7 43.69,29.97 33.53,29.97 32.26,28.7 27.94,28.7 VR4.P$3
N$1  (1 unrouted)
  Top 0.305: R19.2 31.24,12.7 31.24,15.75 C1.1 30.99,16 30.99,17.78 27.94,20.83 U1.2 27.94,21.08 26.16,22.86 26.16,23.88 29.21,26.92 29.21,28.96 32.26,32 32.26,33.02 R16.1 32.51,33.02 32.51,46.74 33.53,47.75 33.53,49.78 32.51,50.8 R15.1 | 32.51,85.34 33.53,84.33 33.53,69.6 32.51,68.58 R14.1
  Bottom 0.305: R15.1 32.51,50.8 32.51,64.52 33.53,65.53 33.53,67.56 32.51,68.58 R14.1
N$2
  Top 0.305: R13.2 27.18,83.82 25.4,82.04 VR1.P$2
N$3
  Bottom 0.305: R16.2 27.18,30.48 25.4,28.7 VR4.P$2
N$4
  Top 0.305: U6.3 12.7,83.82 12.7,90.17 R1.2
N$5
  Top 0.305: R14.2 27.18,66.04 25.4,64.26 VR2.P$2
N$6
  Top 0.305: JP1.2 JP1.1 D1.A
N$7
  Top 0.305: R15.2 27.18,48.26 25.4,46.48 VR3.P$2
N$9
  Top 0.305: R19.1 R20.2 | C1.2 28.7,23.37 27.94,23.37 U1.1
  Bottom 0.305: R19.1 28.45,12.7 28.45,13.21 26.16,15.49 26.16,21.59 27.94,23.37 U1.1
N$10
  Top 0.305: R20.1 R21.2 19.56,12.7 19.56,13.46 C2.2 19.56,18.29 20.32,18.29 U1.6
N$11
  Top 0.305: 17.27,21.08 20.32,21.08 U1.7 | 17.27,21.08 17.27,24.13 R22.2 | 17.27,21.08 C2.1
N$12
  Top 0.305: R21.1 17.27,12.7 17.27,7.37 18.29,6.35 J7.P3
  Bottom 0.305: R22.1 17.27,26.67 17.27,25.65 18.54,24.38 18.54,13.97 17.27,12.7 R21.1
N$15
  Top 0.305: R2.2 U6.5
N$17
  Top 0.305: U5.3 12.7,48.26 12.7,54.61 R3.2
N$20
  Top 0.305: JP1.10 JP1.9 D2.C
N$21
  Top 0.305: R7.2 15.24,93.47 12.19,93.47 R1.1 11.94,93.47 5.08,93.47 J1.P3
N$23
  Top 0.305: R30.2 44.96,30.48 43.18,28.7 VR8.P$2
N$24
  Top 0.305: R27.1 50.29,86.36 50.29,85.34 51.31,84.33 51.31,69.6 50.29,68.58 R28.1 | U2.2 45.72,20.83 48.77,17.78 48.77,16 C7.1 49.02,15.75 49.02,12.7 R33.2 | R29.1 51.44,49.53 51.44,34.29 R30.1
  Bottom 0.305: R29.1 50.29,50.8 50.29,64.52 51.31,65.53 51.31,67.56 50.29,68.58 R28.1 | R30.1 50.04,33.02 50.04,32 47.5,29.46 47.5,22.86 45.72,21.08 U2.2
N$25
  Top 0.305: R33.1 R34.2 | C7.2 46.48,23.37 45.72,23.37 U2.1
  Bottom 0.305: C7.2 47.5,19.56 47.5,15.49 46.48,14.48 46.48,12.7 R33.1
N$26
  Top 0.305: R34.1 R35.2 37.34,12.7 37.34,13.46 C8.2 37.34,18.29 38.1,18.29 U2.6
N$27
  Top 0.305: J10.P3 36.07,6.35 35.05,7.37 35.05,12.7 R35.1 34.8,12.7 33.53,13.97 33.53,24.38 34.8,25.65 34.8,26.67 R36.1
N$29
  Top 0.305: 35.05,21.08 38.1,21.08 U2.7 | 35.05,21.08 35.05,24.13 R36.2 | 35.05,21.08 C8.1
N$31
  Top 0.305: R2.1 R8.2
  Bottom 0.305: J2.P3 5.08,75.44 8.64,75.44 11.18,72.9 12.95,72.9 13.97,71.88 R2.1
N$33
  Top 0.305: R9.2 15.24,57.91 12.19,57.91 R3.1 11.94,57.91 5.08,57.91 J3.P3
N$34
  Top 0.305: R4.1 R10.2
  Bottom 0.305: J4.P3 5.08,39.88 8.64,39.88 11.18,37.34 12.95,37.34 13.97,36.32 R4.1
N$36
  Top 0.305: R27.2 44.96,83.82 43.18,82.04 VR5.P$2
N$37
  Top 0.305: R28.2 44.96,66.04 43.18,64.26 VR6.P$2
N$38
  Top 0.305: R29.2 44.96,48.26 43.18,46.48 VR7.P$2
N$40
  Top 0.305: R4.2 U5.5
N$53
  Top 0.305: R40.2 62.74,30.48 60.96,28.7 VR12.P$2
N$54
  Top 0.305: R41.2 66.8,12.7 66.8,15.75 C9.1 | 68.07,50.8 68.07,64.52 69.09,65.53 69.09,67.56 68.07,68.58 | 68.07,68.58 69.09,69.6 69.09,84.33 68.07,85.34 68.07,86.36 R37.1 | 68.07,68.58 R38.1 | 68.07,50.8 69.09,49.78 69.09,47.75 68.07,46.74 68.07,33.02 R40.1 | 68.07,50.8 R39.1
  Bottom 0.305: C9.1 66.55,16 66.55,17.78 63.5,20.83 U3.2 63.5,21.08 65.28,22.86 65.28,29.46 67.82,32 67.82,33.02 R40.1
N$55
  Top 0.305: R42.2 R41.1 64.26,12.7 64.26,14.48 65.28,15.49 65.28,19.56 C9.2 64.26,23.37 63.5,23.37 U3.1
N$56
  Top 0.305: R42.1 R43.2 55.12,12.7 55.12,13.46 C10.2 55.12,18.29 55.88,18.29 U3.6
N$57
  Top 0.305: R43.1 52.83,12.7 52.83,7.37 53.85,6.35 J11.P3
  Bottom 0.305: R44.1 52.83,26.67 52.83,25.65 54.1,24.38 54.1,13.97 52.83,12.7 R43.1
N$58
  Top 0.305: 52.83,21.08 55.88,21.08 U3.7 | 52.83,21.08 52.83,24.13 R44.2 | 52.83,21.08 C10.1
N$62
  Top 0.305: R37.2 62.74,83.82 60.96,82.04 VR9.P$2
N$63
  Top 0.305: R38.2 62.74,66.04 60.96,64.26 VR10.P$2
N$64
  Top 0.305: R39.2 62.74,48.26 60.96,46.48 VR11.P$2
N$109
  Top 0.305: R48.2 80.52,30.48 78.74,28.7 VR16.P$2
N$110
  Top 0.305: R49.2 84.58,12.7 84.58,15.75 C11.1
  Bottom 0.305: C11.1 84.33,16 84.33,17.78 81.28,20.83 U4.2 81.28,21.08 83.06,22.86 83.06,29.46 85.6,32 85.6,33.02 R48.1 85.85,33.02 85.85,46.74 86.87,47.75 86.87,49.78 85.85,50.8 | 85.85,50.8 85.85,64.52 86.87,65.53 86.87,67.56 85.85,68.58 R46.1 85.6,68.58 85.6,71.37 84.58,72.39 84.58,83.82 85.6,84.84 85.6,85.6 R45.1 | 85.85,50.8 R47.1
N$111
  Top 0.305: R50.2 R49.1 82.04,12.7 82.04,14.48 83.06,15.49 83.06,19.56 C11.2 82.04,23.37 81.28,23.37 U4.1
N$112
  Top 0.305: R50.1 R51.2 72.9,12.7 72.9,13.46 C12.2 72.9,18.29 73.66,18.29 U4.6
N$113
  Top 0.305: R51.1 70.61,12.7 70.61,7.37 71.63,6.35 J12.P3
  Bottom 0.305: R52.1 70.61,26.67 70.61,25.65 71.88,24.38 71.88,13.97 70.61,12.7 R51.1
N$114
  Top 0.305: 70.61,21.08 73.66,21.08 U4.7 | 70.61,21.08 70.61,24.13 R52.2 | 70.61,21.08 C12.1
N$118
  Top 0.305: R45.2 85.6,83.31 80.01,83.31 78.74,82.04 VR13.P$2
N$119
  Top 0.305: R46.2 80.52,66.04 78.74,64.26 VR14.P$2
N$120
  Top 0.305: R47.2 80.52,48.26 78.74,46.48 VR15.P$2
VCC
  Top 0.305: 73.66,25.4 C23.1 73.66,25.91 | 73.66,25.4 U4.8 | 38.1,24.64 C19.1 38.1,26.16 37.08,26.16 35.31,27.94 34.54,27.94 32.51,25.91 32.51,12.45 31.5,11.43 30.73,11.43 29.72,12.45 29.72,16.26 28.7,17.27 26.42,17.27 20.32,23.37 U1.8 C17.1 20.32,26.16 19.3,26.16 17.53,27.94 9.65,27.94 | 38.1,24.64 U2.8 | 55.88,25.4 C21.1 55.88,25.91 | 55.88,25.4 55.88,24.13 | 55.88,24.13 U3.8 | 38.1,24.64 51.56,24.64 52.32,25.4 55.88,25.4 | 73.66,25.4 62.74,25.4 61.47,24.13 55.88,24.13 | C15.1 U6.8 | C13.1 U5.8 9.65,45.21 9.65,27.94 | C3.+ 6.86,13.97 2.54,18.29 D1.C C5.1 8.89,27.94 9.65,27.94
  Bottom 0.305: U6.8 15.24,78.74 15.24,59.44 16.51,58.17 16.51,54.61 C13.1
VEE
  Top 0.305: U2.4 45.72,14.99 47.75,12.95 47.75,11.43 48.77,10.41 | 48.77,10.41 49.53,9.65 C20.2 49.53,7.62 46.48,4.57 36.07,4.57 31.75,8.89 C18.2 | 48.77,10.41 52.32,13.97 53.09,13.97 54.1,12.95 54.1,12.19 54.86,11.43 58.93,11.43 59.69,12.19 59.69,13.21 62.23,15.75 63.5,15.75 U3.4 | C22.2 67.31,8.89 71.12,5.08 72.39,5.08 76.71,9.4 85.09,9.4 C24.2 | U6.4 19.05,73.66 C16.2 | U5.4 19.05,38.1 C14.2 | 12.7,18.54 7.62,18.54 C4.- | 12.7,18.54 12.7,19.56 | 12.7,19.56 C6.2 | 12.7,18.54 D2.A | 12.7,19.56 21.34,19.56 24.89,16 27.94,16 U1.4
  Bottom 0.305: U4.4 81.28,14.99 83.31,12.95 83.31,11.43 85.09,9.65 C24.2 | U3.4 63.5,14.99 65.53,12.95 65.53,11.43 67.31,9.65 C22.2 | U1.4 27.94,14.99 29.97,12.95 29.97,11.43 31.75,9.65 C18.2 | C6.2 13.97,22.86 13.97,29.72 17.02,32.77 17.02,36.07 C14.2 | U5.4 17.27,41.15 17.27,47.5 18.54,48.77 18.54,67.06 17.27,68.33 17.27,71.63 C16.2

### Text on the board
bPlace: -12v